# Altium schematic sheet mixer.SchDoc
size A4
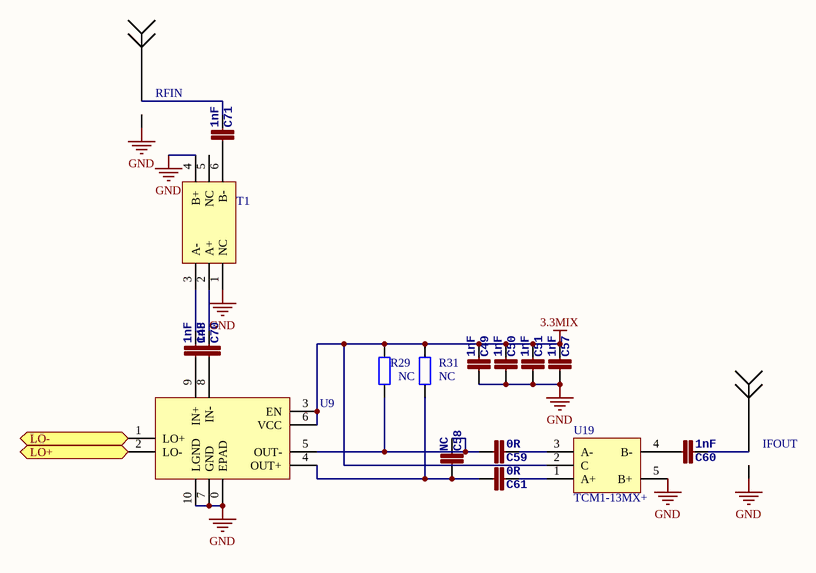
[diagram p0: mixer.SchDoc]

## Parts
C48  1nF  [0402]
C49  1nF  [0402]
C50  1nF  [0402]
C51  1nF  [0402]
C57  1nF  [0402]
C58  NC  [0402]
C59  0R  [0402]
C60  1nF  [0402]
C61  0R  [0402]
C70  1nF  [0402]
C71  1nF  [0402]
IFOUT  Antenna  [SMA-2B]  (value not drawn)
R29  NC  [0402]
R31  NC  [0402]
RFIN  Antenna  [SMA-2B]  (value not drawn)
T1  TCM1-63AX+  [TCM1-63AX+]  (value not drawn)
U9  LTC5562  [LTC5562]  (value not drawn)
U19  TCM1-13MX+  [TCM-13M+]

## Ports
LO+, LO-

## Nets
3.3MIX: C49.2 C50.2 C51.2 C57.2 R29.2 R31.2 U9.3(EN) U9.6(VCC) U19.2(C)
GND: C49.1 C50.1 C51.1 C57.1 IFOUT.GND(G) RFIN.GND(G) T1.1(NC) T1.4(B+) U9.0(EPAD) U9.7(GND) U9.10(LGND) U19.5(B+)
LO+: U9.2(LO-) ; port LO+
LO-: U9.1(LO+) ; port LO-
NetC48_1: C48.1 U9.9(IN+)
NetC48_2: C48.2 T1.3(A-)
NetC58_1: C58.1 C61.1 R31.1 U9.4(OUT+)
NetC58_2: C58.2 C59.1 R29.1 U9.5(OUT-)
NetC59_2: C59.2 U19.3(A-)
NetC60_1: C60.1 U19.4(B-)
NetC60_2: C60.2 IFOUT.1
NetC61_2: C61.2 U19.1(A+)
NetC70_1: C70.1 U9.8(IN-)
NetC70_2: C70.2 T1.2(A+)
NetC71_1: C71.1 T1.6(B-)
NetC71_2: C71.2 RFIN.1

Not connected (* = marked no-connect by the designer): T1 5(NC)

## Library data of the parts
C48-C51 C57-C61 C70 C71 = CAP0402-CAP: <b>Capacitor</b> / Standard 0603 ceramic capacitor, and 0.1" leaded capacitor.; PARTNO: CC0402ZRY5V7BB104
R29 R31 = Res2: Resistor; Published: 8-Jun-2000; LatestRevisionDate: 17-Jul-2002; LatestRevisionNote: Re-released for DXP Platform.; PackageReference: AXIAL-0.4; Publisher: Altium Limited; PackageDescription: Axial Device, Thru-Hole; 2 Leads; 0.4 in Pin Spacing
U19 = TCM-63AX+